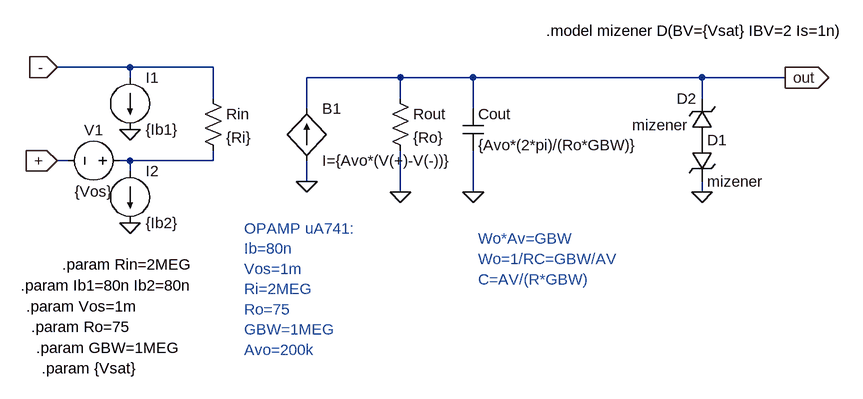
[diagram p0: schematic opamp-real.asc]
opamp-real.asc, the LTspice schematic file:
Version 4
SHEET 1 1040 680
WIRE -112 -16 -224 -16
WIRE 16 -16 -112 -16
WIRE -112 0 -112 -16
WIRE 304 0 160 0
WIRE 416 0 304 0
WIRE 768 0 416 0
WIRE 896 0 768 0
WIRE 16 32 16 -16
WIRE 304 32 304 0
WIRE 768 32 768 0
WIRE 160 48 160 0
WIRE 416 48 416 0
WIRE -208 128 -224 128
WIRE -112 128 -128 128
WIRE 16 128 16 112
WIRE 16 128 -112 128
WIRE -112 144 -112 128
WIRE 160 160 160 128
WIRE 304 176 304 112
WIRE 416 176 416 112
WIRE 768 176 768 160
FLAG 160 160 0
FLAG 304 176 0
FLAG -224 -16 -
IOPIN -224 -16 In
FLAG -224 128 +
IOPIN -224 128 In
FLAG 896 0 out
IOPIN 896 0 Out
FLAG 416 176 0
FLAG -112 80 0
FLAG -112 224 0
FLAG 768 176 0
SYMBOL res 288 16 R0
SYMATTR InstName Rout
SYMATTR Value {Ro}
SYMBOL cap 400 48 R0
SYMATTR InstName Cout
SYMATTR Value {Avo*(2*pi)/(Ro*GBW)}
SYMBOL bi2 160 48 R0
SYMATTR InstName B1
SYMATTR Value I={Avo*(V(+)-V(-))}
SYMBOL res 0 16 R0
SYMATTR InstName Rin
SYMATTR Value {Ri}
SYMBOL current -112 0 R0
SYMATTR InstName I1
SYMATTR Value {Ib1}
SYMBOL current -112 144 R0
SYMATTR InstName I2
SYMATTR Value {Ib2}
SYMBOL voltage -112 128 R90
WINDOW 0 -32 56 VBottom 2
WINDOW 3 32 56 VTop 2
SYMATTR InstName V1
SYMATTR Value {Vos}
SYMBOL zener 752 96 R0
SYMATTR InstName D1
SYMATTR Value mizener
SYMBOL zener 784 96 R180
WINDOW 0 24 64 Left 2
WINDOW 3 37 23 Left 2
SYMATTR InstName D2
SYMATTR Value mizener
TEXT 64 232 Left 2 ;OPAMP uA741:\nIb=80n\nVos=1m\nRi=2MEG\nRo=75\nGBW=1MEG\nAvo=200k
TEXT 424 248 Left 2 ;Wo*Av=GBW\nWo=1/RC=GBW/AV\nC=AV/(R*GBW)
TEXT 528 -72 Left 2 !.model mizener D(BV={Vsat} IBV=2 Is=1n)
TEXT -216 288 Left 2 !.param Rin=2MEG
TEXT -280 320 Left 2 !.param Ib1=80n Ib2=80n
TEXT -272 352 Left 2 !.param Vos=1m
TEXT -264 384 Left 2 !.param Ro=75
TEXT -256 416 Left 2 !.param GBW=1MEG
TEXT -248 448 Left 2 !.param {Vsat}

The netlist it stands for:
* opamp-real.asc
Rout out 0 {Ro}
Cout out 0 {Avo*(2*pi)/(Ro*GBW)}
B1 0 out I={Avo*(V(+)-V(-))}
Rin - N001 {Ri}
I1 - 0 {Ib1}
I2 N001 0 {Ib2}
V1 N001 + {Vos}
D1 P001 0 mizener
D2 P001 out mizener
.model D D
.lib standard.dio
* OPAMP uA741:
* Ib=80n
* Vos=1m
* Ri=2MEG
* Ro=75
* GBW=1MEG
* Avo=200k
* Wo*Av=GBW
* Wo=1/RC=GBW/AV
* C=AV/(R*GBW)
.model mizener D(BV={Vsat} IBV=2 Is=1n)
.param Rin=2MEG
.param Ib1=80n Ib2=80n
.param Vos=1m
.param Ro=75
.param GBW=1MEG
.param {Vsat}
.backanno
.end